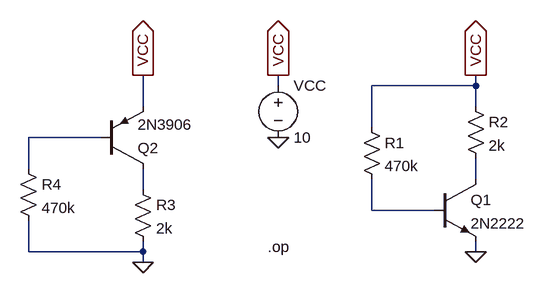
[diagram p0: schematic 005 TJB.asc]
005 TJB.asc, the LTspice schematic file:
Version 4
SHEET 1 880 680
WIRE -144 -32 -144 -48
WIRE 160 -32 160 -48
WIRE 160 -32 0 -32
WIRE -352 0 -352 -48
WIRE 160 0 160 -32
WIRE 0 32 0 -32
WIRE -416 48 -528 48
WIRE -528 96 -528 48
WIRE 160 112 160 80
WIRE -352 128 -352 96
WIRE 0 160 0 112
WIRE 96 160 0 160
WIRE -528 224 -528 176
WIRE -352 224 -352 208
WIRE -352 224 -528 224
WIRE 160 224 160 208
WIRE -352 240 -352 224
FLAG -144 48 0
FLAG 160 224 0
FLAG -352 240 0
FLAG -352 -48 VCC
IOPIN -352 -48 Out
FLAG 160 -48 VCC
IOPIN 160 -48 Out
FLAG -144 -48 VCC
IOPIN -144 -48 Out
SYMBOL npn 96 112 R0
SYMATTR InstName Q1
SYMATTR Value 2N2222
SYMBOL voltage -144 -48 R0
SYMATTR InstName VCC
SYMATTR Value 10
SYMBOL res 144 -16 R0
SYMATTR InstName R2
SYMATTR Value 2k
SYMBOL res -16 16 R0
SYMATTR InstName R1
SYMATTR Value 470k
SYMBOL pnp -416 96 M180
SYMATTR InstName Q2
SYMATTR Value 2N3906
SYMBOL res -368 112 R0
SYMATTR InstName R3
SYMATTR Value 2k
SYMBOL res -544 80 R0
SYMATTR InstName R4
SYMATTR Value 470k
TEXT -160 216 Left 2 !.op

The netlist it stands for:
* 005 TJB.asc
Q1 N002 N004 0 0 2N2222
VCC VCC 0 10
R2 VCC N002 2k
R1 VCC N004 470k
Q2 N003 N001 VCC 0 2N3906
R3 N003 0 2k
R4 N001 0 470k
.model NPN NPN
.model PNP PNP
.lib standard.bjt
.op
.backanno
.end